# Altium schematic sheet Sheet1.SchDoc
size A4; SheetNumber: 1; SheetTotal: 1
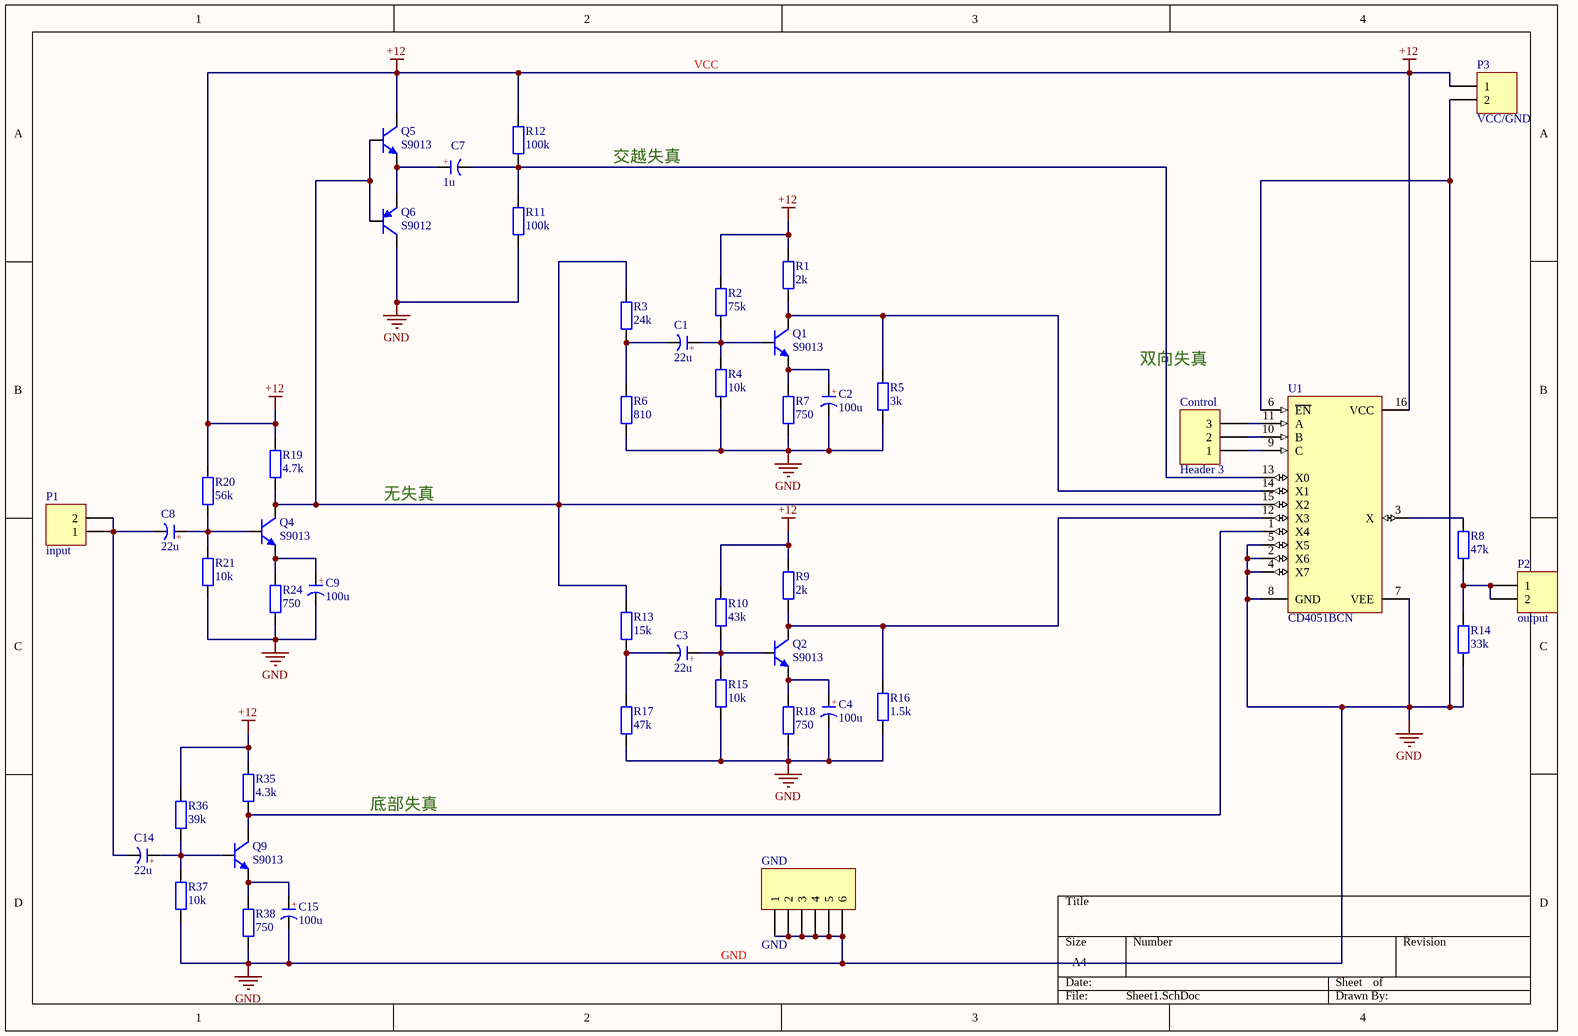
[diagram p0: Sheet1.SchDoc]

## Parts
C1  22u  [CS 3.5*8*8 - R]
C2  100u  [CS 3.5*8*8 - R]
C3  22u  [CS 3.5*8*8 - R]
C4  100u  [CS 3.5*8*8 - R]
C7  1u  [CS 3.5*8*8 - R]
C8  22u  [CS 3.5*8*8 - R]
C9  100u  [CS 3.5*8*8 - R]
C14  22u  [CS 3.5*8*8 - R]
C15  100u  [CS 3.5*8*8 - R]
Control  Header 3  [HDR1X3]
GND  GND  [HDR1X6]
P1  input  [HDR1X2]
P2  output  [HDR1X2]
P3  VCC/GND  [XH2.54-LI-2P]
Q1  S9013  [TO92]
Q2  S9013  [TO92]
Q4  S9013  [TO92]
Q5  S9013  [TO92]
Q6  S9012  [TO92]
Q9  S9013  [TO92]
R1  2k  [RS 1/4W]
R2  75k  [RS 1/4W]
R3  24k  [RS 1/4W]
R4  10k  [RS 1/4W]
R5  3k  [RS 1/4W]
R6  810  [RS 1/4W]
R7  750  [RS 1/4W]
R8  47k  [RS 1/4W]
R9  2k  [RS 1/4W]
R10  43k  [RS 1/4W]
R11  100k  [RS 1/4W]
R12  100k  [RS 1/4W]
R13  15k  [RS 1/4W]
R14  33k  [RS 1/4W]
R15  10k  [RS 1/4W]
R16  1.5k  [RS 1/4W]
R17  47k  [RS 1/4W]
R18  750  [RS 1/4W]
R19  4.7k  [RS 1/4W]
R20  56k  [RS 1/4W]
R21  10k  [RS 1/4W]
R24  750  [RS 1/4W]
R35  4.3k  [RS 1/4W]
R36  39k  [RS 1/4W]
R37  10k  [RS 1/4W]
R38  750  [RS 1/4W]
U1  CD4051BCN  [N16E]

## Nets
+12: P3.1 Q5.3(C) R1.2 R2.2 R9.2 R10.2 R12.2 R19.2 R20.2 R35.2 R36.2 U1.16(VCC)
GND: C2.2(K) C4.2(K) C9.2(K) C15.2(K) GND.1 GND.2 GND.3 GND.4 GND.5 GND.6 P3.2 Q6.3(C) R4.1 R5.1 R6.1 R7.1 R11.1 R14.1 R15.1 R16.1 R17.1 R18.1 R21.1 R24.1 R37.1 R38.1 U1.2(X6) U1.4(X7) U1.5(X5) U1.6(~{EN}) U1.7(VEE) U1.8(GND)
NetC1_1: C1.1(A) Q1.2(B) R2.1 R4.2
NetC1_2: C1.2(K) R3.1 R6.2
NetC2_1: C2.1(A) Q1.1(E) R7.2
NetC3_1: C3.1(A) Q2.2(B) R10.1 R15.2
NetC3_2: C3.2(K) R13.1 R17.2
NetC4_1: C4.1(A) Q2.1(E) R18.2
NetC7_1: C7.1(A) Q5.1(E) Q6.1(E)
NetC7_2: C7.2(K) R11.2 R12.1 U1.13(X0)
NetC8_1: C8.1(A) Q4.2(B) R20.1 R21.2
NetC8_2: C8.2(K) C14.2(K) P1.1 P1.2
NetC9_1: C9.1(A) Q4.1(E) R24.2
NetC14_1: C14.1(A) Q9.2(B) R36.1 R37.2
NetC15_1: C15.1(A) Q9.1(E) R38.2
NetControl_1: Control.1 U1.9(C)
NetControl_2: Control.2 U1.10(B)
NetControl_3: Control.3 U1.11(A)
NetP2_1: P2.1 P2.2 R8.1 R14.2
NetQ1_3: Q1.3(C) R1.1 R5.2 U1.14(X1)
NetQ2_3: Q2.3(C) R9.1 R16.2 U1.12(X3)
NetQ4_3: Q4.3(C) Q5.2(B) Q6.2(B) R3.2 R13.2 R19.1 U1.15(X2)
NetQ9_3: Q9.3(C) R35.1 U1.1(X4)
NetR8_2: R8.2 U1.3(X)

## Notes on the sheet
- VCC
- 交越失真
- 双向失真
- 无失真
- 底部失真
- GND
- (in symbol C-CS) +

## Library data of the parts
C1-C4 C7-C9 C14 C15 = C-CS: 直插固态电容; 版权归属: 源创客; BOM名称: 直插固态电容; 学习资源: www.ooocke.com
Control = Header 3: Header, 3-Pin; LatestRevisionDate: 17-Jul-2002; LatestRevisionNote: Re-released for DXP Platform.; Publisher: Altium Limited
GND = Header 6: Header, 6-Pin; LatestRevisionDate: 17-Jul-2002; LatestRevisionNote: Re-released for DXP Platform.; Publisher: Altium Limited
P1-P3 = Header 2: Header, 2-Pin; LatestRevisionDate: 17-Jul-2002; LatestRevisionNote: Re-released for DXP Platform.; Publisher: Altium Limited
Q1 Q2 Q4 Q5 Q9 = 9013-DIP: 低频放大-NPN型; 版权归属: 源创客; 属性: 50V 0.5A 0.625W; BOM名称: 低频放大-NPN型; 学习资源: www.ooocke.com
Q6 = 9012-DIP: 低频放大-PNP型; 版权归属: 源创客; 属性: 50V 0.5A 0.625W; BOM名称: 低频放大-PNP型; 学习资源: www.ooocke.com
R1-R21 R24 R35-R38 = R-CRR: 直插色环电阻; BOM名称: 色环电阻; 版权归属: 源创客; 学习资源: www.ooocke.com
U1 = CD4051BCN: 8-Channel Analog Multiplexer/Demultiplexer; Published: 17-Jul-2002; LatestRevisionDate: 29-May-2009; LatestRevisionNote: Component Body Added.; DatasheetVersion: Jan-1999; PackageVersion: 2000; PackageReference: N16E; Publisher: Altium Limited; PackageDescription: DIP, 16-Pin, Row Spacing 7.62 mm, Pitch 2.54 mm; ComponentLink1Description: Manufacturer Link; ComponentLink1URL: http://www.fairchildsemi.com/; ComponentLink2Description: Datasheet; ComponentLink2URL: http://www.fairchildsemi.com/ds/CD%2FCD4052BC.pdf